# Altium schematic sheet Charlieplex_12LED.SchDoc
size A4
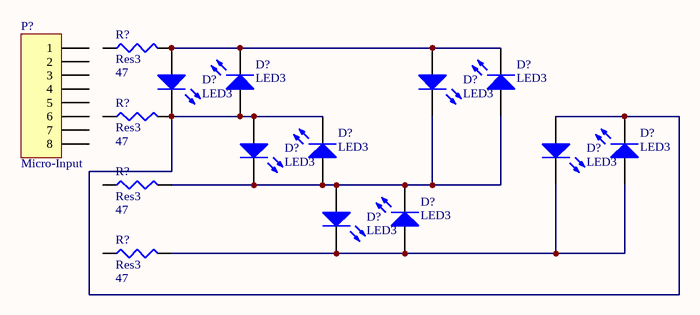
[diagram p0: Charlieplex_12LED.SchDoc]

## Parts
(Parts that share a designator on the sheet are numbered #1, #2 ... from top to bottom, then left to right.)
D?#1  LED3  [3.5X2.8X1.9]
D?#2  LED3  [3.5X2.8X1.9]
D?#3  LED3  [3.5X2.8X1.9]
D?#4  LED3  [3.5X2.8X1.9]
D?#5  LED3  [3.5X2.8X1.9]
D?#6  LED3  [3.5X2.8X1.9]
D?#7  LED3  [3.5X2.8X1.9]
D?#8  LED3  [3.5X2.8X1.9]
D?#9  LED3  [3.5X2.8X1.9]
D?#10  LED3  [3.5X2.8X1.9]
P?  Micro-Input  [HDR1X8H]
R?#1  Res3  value 47  [J1-0603]
R?#2  Res3  value 47  [J1-0603]
R?#3  Res3  value 47  [J1-0603]
R?#4  Res3  value 47  [J1-0603]

## Nets
NetD?#1_1: D?#1.1(A) D?#2.1(A) D?#3.2(K) D?#4.2(K) R?#1.2
NetD?#1_2: D?#1.2(K) D?#3.1(A) D?#5.1(A) D?#6.1(A) D?#7.2(K) D?#8.2(K) R?#2.2
NetD?#2_2: D?#2.2(K) D?#4.1(A) D?#5.2(K) D?#7.1(A) D?#9.1(A) D?#10.2(K) R?#3.2
NetD?#6_2: D?#6.2(K) D?#8.1(A) D?#9.2(K) D?#10.1(A) R?#4.2

Not connected (* = marked no-connect by the designer): P? 1 2 3 4 5 6 7 8; R?#1 1; R?#2 1; R?#3 1; R?#4 1

## Library data of the parts
D?#1-D?#10 = LED3: Typical BLUE SiC LED; Published: 8-Jun-2000; LatestRevisionDate: 17-Dec-2003; LatestRevisionNote: PCB Footprint replaced.; DatasheetVersion: 16-Apr-2002; PackageVersion: 16-Apr-2002; PackageReference: 3.5X2.8X1.9; Publisher: Altium Limited; PackageDescription: SM LED; 2 C-Bend Leads; Body 3.5 x 2.8 x 1.9 mm, inc leads (LxWxH typ)
P? = Header 8H: Header, 8-Pin, Right Angle; LatestRevisionDate: 17-Jul-2002; LatestRevisionNote: Re-released for DXP Platform.; Publisher: Altium Limited
R?#1-R?#4 = Res3: Resistor; Published: 8-Jun-2000; LatestRevisionDate: 29-May-2009; LatestRevisionNote: IPC-7351 Footprint Added.; PackageReference: J1-0603; Publisher: Altium Limited; PackageDescription: Chip Resistor